# EAGLE schematic pcb (EAGLE 7.3.0)
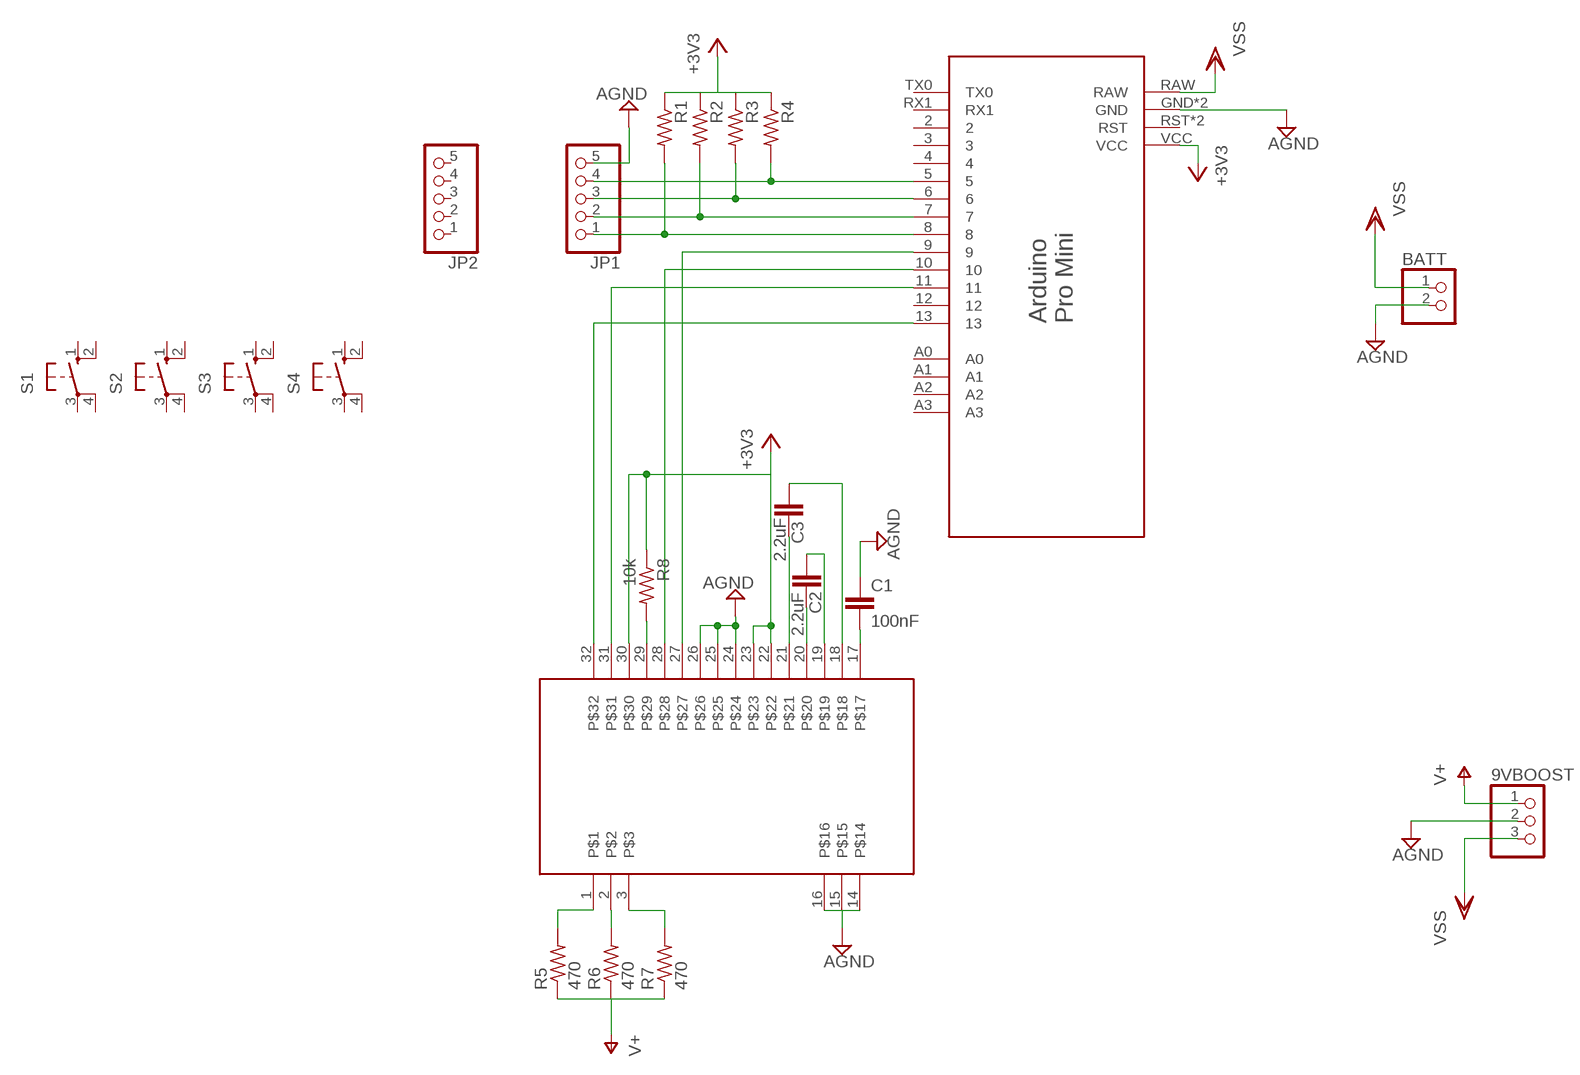
[diagram p0: schematic, sheet 1]

## Parts
9VBOOST  PINHD-1X3  [1X03]
BATT  PINHD-1X2  [1X02]
C1  100nF  C-EU050-030X075  [C050-030X075]
C2  2.2uF  C-EU050-030X075  [C050-030X075]
C3  2.2uF  C-EU050-030X075  [C050-030X075]
DOGXL160  DOGXL160-7  [EA_DOGXL160-7]
JP1  PINHD-1X5  [1X05]
JP2  PINHD-1X5  [1X05]
R1  R-US_V234/12  [V234/12]
R2  R-US_V234/12  [V234/12]
R3  R-US_V234/12  [V234/12]
R4  R-US_V234/12  [V234/12]
R5  470  R-US_V234/12  [V234/12]
R6  470  R-US_V234/12  [V234/12]
R7  470  R-US_V234/12  [V234/12]
R8  10k  R-US_V234/12  [V234/12]
S1  10-XX  [B3F-10XX]
S2  10-XX  [B3F-10XX]
S3  10-XX  [B3F-10XX]
S4  10-XX  [B3F-10XX]
U$1  PRO_MINI  [PRO_MINI]

## Nets
+3V3: DOGXL160.22 DOGXL160.23 DOGXL160.30 R1.1 R2.1 R3.1 R4.1 R8.1 U$1.VCC
AGND: 9VBOOST.2 BATT.2 C1.1 DOGXL160.14 DOGXL160.15 DOGXL160.16 DOGXL160.24 DOGXL160.25 DOGXL160.26 JP1.5 U$1.GND U$1.GND1(GND)
N$1: DOGXL160.1 R5.2
N$2: DOGXL160.2 R6.2
N$3: DOGXL160.3 R7.2
N$4: C2.1 DOGXL160.20
N$5: JP1.1 R1.2 U$1.8
N$6: JP1.2 R2.2 U$1.7
N$7: JP1.3 R3.2 U$1.6
N$8: JP1.4 R4.2 U$1.5
N$9: C2.2 DOGXL160.19
N$10: C3.1 DOGXL160.18
N$11: C3.2 DOGXL160.21
N$12: C1.2 DOGXL160.17
N$13: DOGXL160.29 R8.2
N$14: DOGXL160.27 U$1.9
N$15: DOGXL160.28 U$1.10
N$16: DOGXL160.31 U$1.11
N$17: DOGXL160.32 U$1.13
V+: 9VBOOST.1 R5.1 R6.1 R7.1
VSS: 9VBOOST.3 BATT.1 U$1.RAW
Unconnected: JP2.1 JP2.2 JP2.3 JP2.4 JP2.5 S1.1(S) S1.2(S1) S1.3(P) S1.4(P1) S2.1(S) S2.2(S1) S2.3(P) S2.4(P1) S3.1(S) S3.2(S1) S3.3(P) S3.4(P1) S4.1(S) S4.2(S1) S4.3(P) S4.4(P1) U$1.2 U$1.3 U$1.4 U$1.12 U$1.A0 U$1.A1 U$1.A2 U$1.A3 U$1.RST U$1.RST1(RST) U$1.RX1 U$1.TX0

## Library data of the parts
9VBOOST = pinhead:PINHD-1X3: PIN HEADER
BATT = pinhead:PINHD-1X2: PIN HEADER
C1-C3 = resistor:C-EU: CAPACITOR, European symbol
DOGXL160 = ea_v6:DOGXL160-7
JP1 JP2 = pinhead:PINHD-1X5: PIN HEADER
R1-R8 = resistor:R-US_: RESISTOR, American symbol
S1-S4 = switch-omron:10-XX: OMRON SWITCH; MPN: B3F-1000; OC_FARNELL: 176432; OC_NEWARK: 36M3542
U$1 = Arduino_Pro_Mini:PRO_MINI